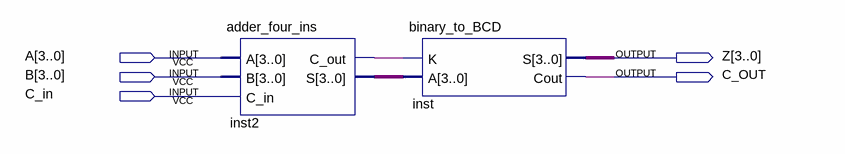
[diagram p0: schematic sheet]
// Quartus schematic adder_4bit_barToBCD.bdf as structural Verilog: 2 symbols, 5 pins
module adder_4bit_barToBCD (
  input  [3:0] A,
  input  [3:0] B,
  input  C_in,
  output [3:0] Z,
  output C_OUT
);

  wire inst2_c_out;
  wire [3:0] inst2_s;

  adder_four_ins inst2 (.A(A), .B(B), .C_in(C_in), .C_out(inst2_c_out), .S(inst2_s));
  binary_to_BCD inst (.K(inst2_c_out), .A(inst2_s), .S(Z), .Cout(C_OUT));
endmodule
